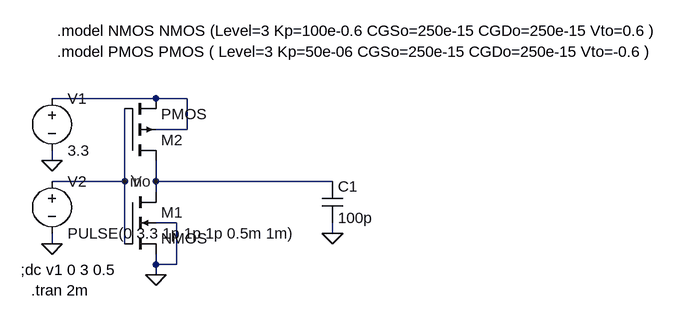
[diagram p0: schematic Inverter.asc]
Inverter.asc, the LTspice schematic file:
Version 4
SHEET 1 1580 680
WIRE 608 -80 448 -80
WIRE 656 -80 608 -80
WIRE 656 -32 656 -80
WIRE 656 -32 608 -32
WIRE 448 16 448 0
WIRE 560 48 560 -64
WIRE 560 48 448 48
WIRE 608 48 608 16
WIRE 880 48 608 48
WIRE 608 64 608 48
WIRE 640 112 608 112
WIRE 880 128 880 112
WIRE 448 144 448 128
WIRE 560 144 560 48
WIRE 608 176 608 160
WIRE 640 176 640 112
WIRE 640 176 608 176
WIRE 608 192 608 176
FLAG 448 16 0
FLAG 448 144 0
FLAG 608 192 0
FLAG 560 48 in
FLAG 880 128 0
FLAG 608 48 Vo
SYMBOL nmos4 560 64 R0
SYMATTR InstName M1
SYMATTR Value2 l=0.75u w=1.5u
SYMBOL pmos4 560 16 M180
SYMATTR InstName M2
SYMATTR Value2 l=0.75u w=3.75u
SYMBOL voltage 448 -96 R0
WINDOW 123 0 0 Left 0
WINDOW 39 0 0 Left 0
SYMATTR InstName V1
SYMATTR Value 3.3
SYMBOL voltage 448 32 R0
WINDOW 123 0 0 Left 0
WINDOW 39 0 0 Left 0
SYMATTR InstName V2
SYMATTR Value PULSE(0 3.3 1p 1p 1p 0.5m 1m)
SYMBOL cap 864 48 R0
SYMATTR InstName C1
SYMATTR Value 100p
TEXT 416 216 Left 2 !.tran 2m
TEXT 456 -152 Left 2 !.model PMOS PMOS ( Level=3 Kp=50e-06 CGSo=250e-15 CGDo=250e-15 Vto=-0.6 )
TEXT 456 -184 Left 2 !.model NMOS NMOS (Level=3 Kp=100e-0.6 CGSo=250e-15 CGDo=250e-15 Vto=0.6 )
TEXT 400 184 Left 2 !;dc v1 0 3 0.5

The netlist it stands for:
* Inverter.asc
M1 Vo in 0 0 NMOS l=0.75u w=1.5u
M2 Vo in N001 N001 PMOS l=0.75u w=3.75u
V1 N001 0 3.3
V2 in 0 PULSE(0 3.3 1p 1p 1p 0.5m 1m)
C1 Vo 0 100p
.model NMOS NMOS
.model PMOS PMOS
.lib standard.mos
.tran 2m
.model PMOS PMOS ( Level=3 Kp=50e-06 CGSo=250e-15 CGDo=250e-15 Vto=-0.6 )
.model NMOS NMOS (Level=3 Kp=100e-0.6 CGSo=250e-15 CGDo=250e-15 Vto=0.6 )
;dc v1 0 3 0.5
.backanno
.end